# EAGLE design H2BR1 (EAGLE 9.6.1)

## Sheet 1 of 2
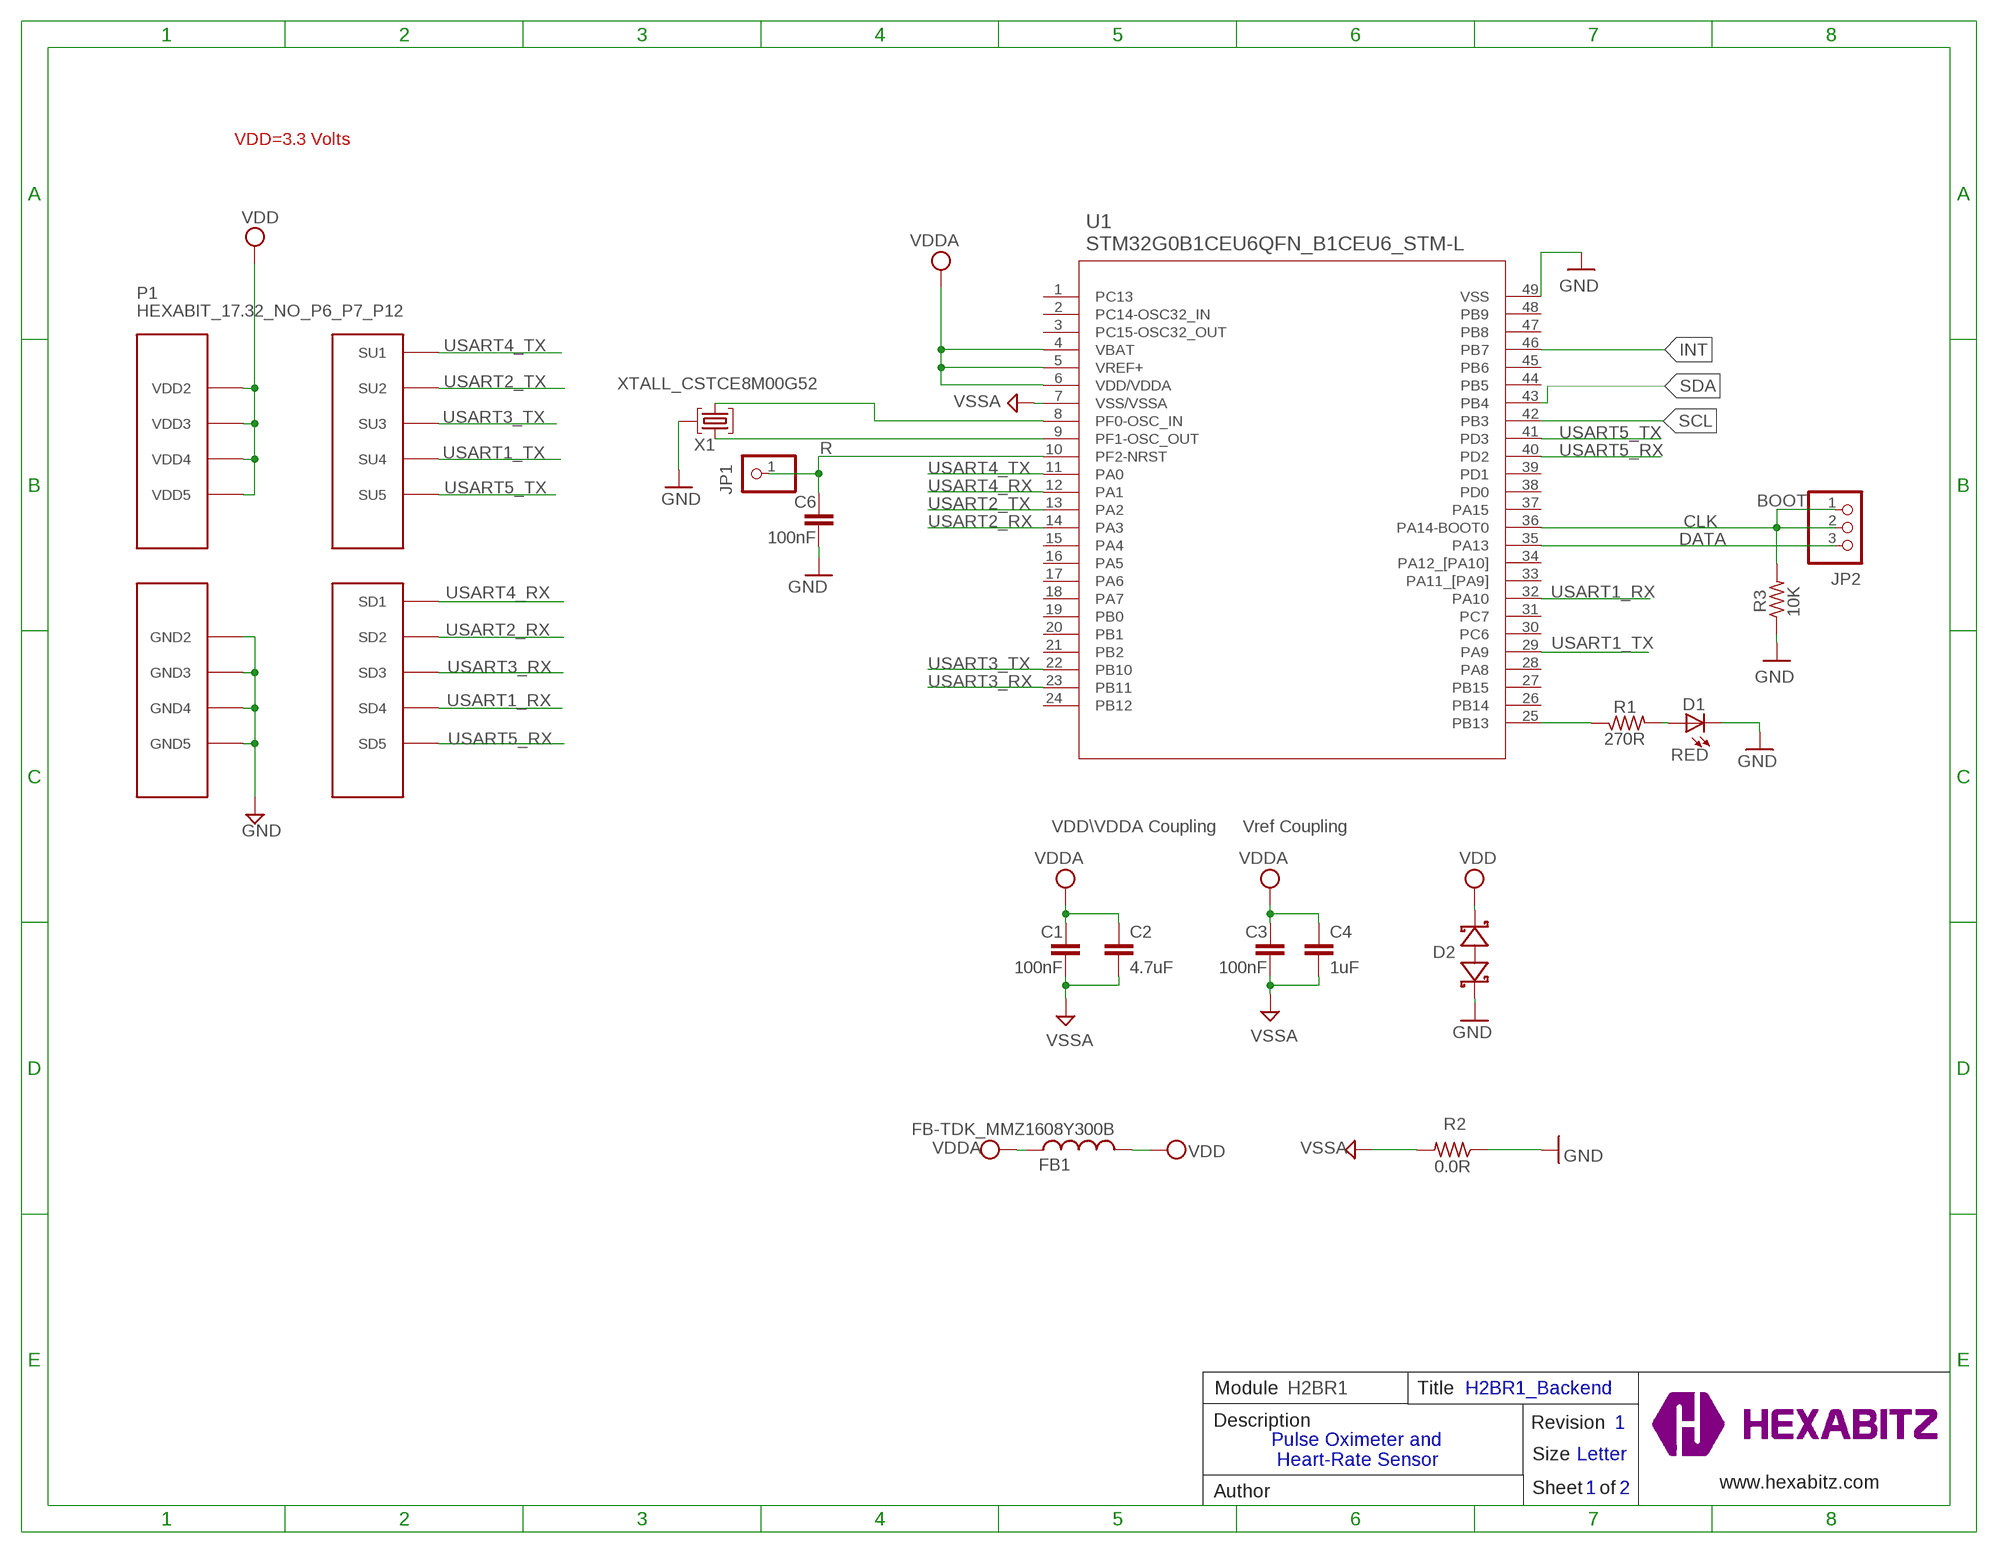
[diagram p0: schematic, sheet 1]

### Parts
C1  100nF  C-0603  [C-0603]
C2  4.7uF  C-0805  [C-0805]
C3  100nF  C-0603  [C-0603]
C4  1uF  C-0805  [C-0805]
C6  100nF  C-0603  [C-0603]
D1  RED  VLMS1300-GS08  [VLMS1300-GS08]
D2  BOURNS_CDSOD323-T03SCBOURNS_CDSOD323-T03SC_0_0  [BOURNS_CDSOD323-T03SC_0]
FB1  FB-TDK_MMZ1608Y300B  FB-0603  [FB-0603]
JP1  R  PINHD-1X1  [1X01]
JP2  PINHD-1X3  [1X03]
P1  HEXABIT_17.32_NO_P6_P7_P12  [HEXABIT_17.32_NO_P6_P7_P12]
R1  270R  R-0603  [R-0603]
R2  0.0R  R-0603  [R-0603]
R3  10K  R-0603  [R-0603]
TRIMBLE-LOGO1  HEXA-LOGO  [HEXA-LOGO]
U1  STM32G0B1CEU6QFN_B1CEU6_STM-L  [QFN_B1CEU6_STM-L]
X1  XTALL_CSTCE8M00G52  [XTALL_CSTCE8M00G52]

### Nets
CLK: JP2.1 JP2.2 R3.2 U1.36(PA14-BOOT0)
DATA: JP2.3 U1.35(PA13)
GND: C6.2 D1.C D2.1(A) P1.PAD_PD8(GND2) P1.PAD_PD9(GND3) P1.PAD_PD10(GND4) P1.PAD_PD11(GND5) R2.1 R3.1 U1.49(VSS) X1.P$2 ; also sheet 2
INT: U1.46(PB7) ; also sheet 2
N$1: R1.1 U1.25(PB13)
N$3: D1.A R1.2
N$4: C6.1 JP1.1 U1.10(PF2-NRST)
N$5: U1.9(PF1-OSC_OUT) X1.P$1
N$6: U1.8(PF0-OSC_IN) X1.P$3
SCL: U1.42(PB3) ; also sheet 2
SDA: U1.43(PB4) ; also sheet 2
USART1_RX: P1.PAD_PD4(SD4) U1.32(PA10)
USART1_TX: P1.PAD_PU4(SU4) U1.29(PA9)
USART2_RX: P1.PAD_PD2(SD2) U1.14(PA3)
USART2_TX: P1.PAD_PU2(SU2) U1.13(PA2)
USART3_RX: P1.PAD_PD3(SD3) U1.23(PB11)
USART3_TX: P1.PAD_PU3(SU3) U1.22(PB10)
USART4_RX: P1.PAD_PD1(SD1) U1.12(PA1)
USART4_TX: P1.PAD_PU1(SU1) U1.11(PA0)
USART5_RX: P1.PAD_PD5(SD5) U1.40(PD2)
USART5_TX: P1.PAD_PU5(SU5) U1.41(PD3)
VDD: D2.2(C) FB1.2 P1.PAD_PU8(VDD2) P1.PAD_PU9(VDD3) P1.PAD_PU10(VDD4) P1.PAD_PU11(VDD5) ; also sheet 2
VDDA: C1.1 C2.1 C3.1 C4.1 FB1.1 U1.4(VBAT) U1.5(VREF+) U1.6(VDD/VDDA)
VSSA: C1.2 C2.2 C3.2 C4.2 R2.2 U1.7(VSS/VSSA)
Unconnected: U1.1(PC13) U1.2(PC14-OSC32_IN) U1.3(PC15-OSC32_OUT) U1.15(PA4) U1.16(PA5) U1.17(PA6) U1.18(PA7) U1.19(PB0) U1.20(PB1) U1.21(PB2) U1.24(PB12) U1.26(PB14) U1.27(PB15) U1.28(PA8) U1.30(PC6) U1.31(PC7) U1.33(PA11_[PA9]) U1.34(PA12_[PA10]) U1.37(PA15) U1.38(PD0) U1.39(PD1) U1.44(PB5) U1.45(PB6) U1.47(PB8) U1.48(PB9)

### Notes on the sheet
- VDD=3.3 Volts
- BOOT
- VDD\VDDA Coupling | Vref Coupling
- Module | H2BR1 | Title | H2BR1_Backend
- Description | Revision | 1
- Size | Letter
- Pulse Oximeter and
   Heart-Rate Sensor
- www.hexabitz.com
- Author | Sheet   of | 1 | 2
- C:/Users/Admin/Desktop/logodraft.bmp

## Sheet 2 of 2
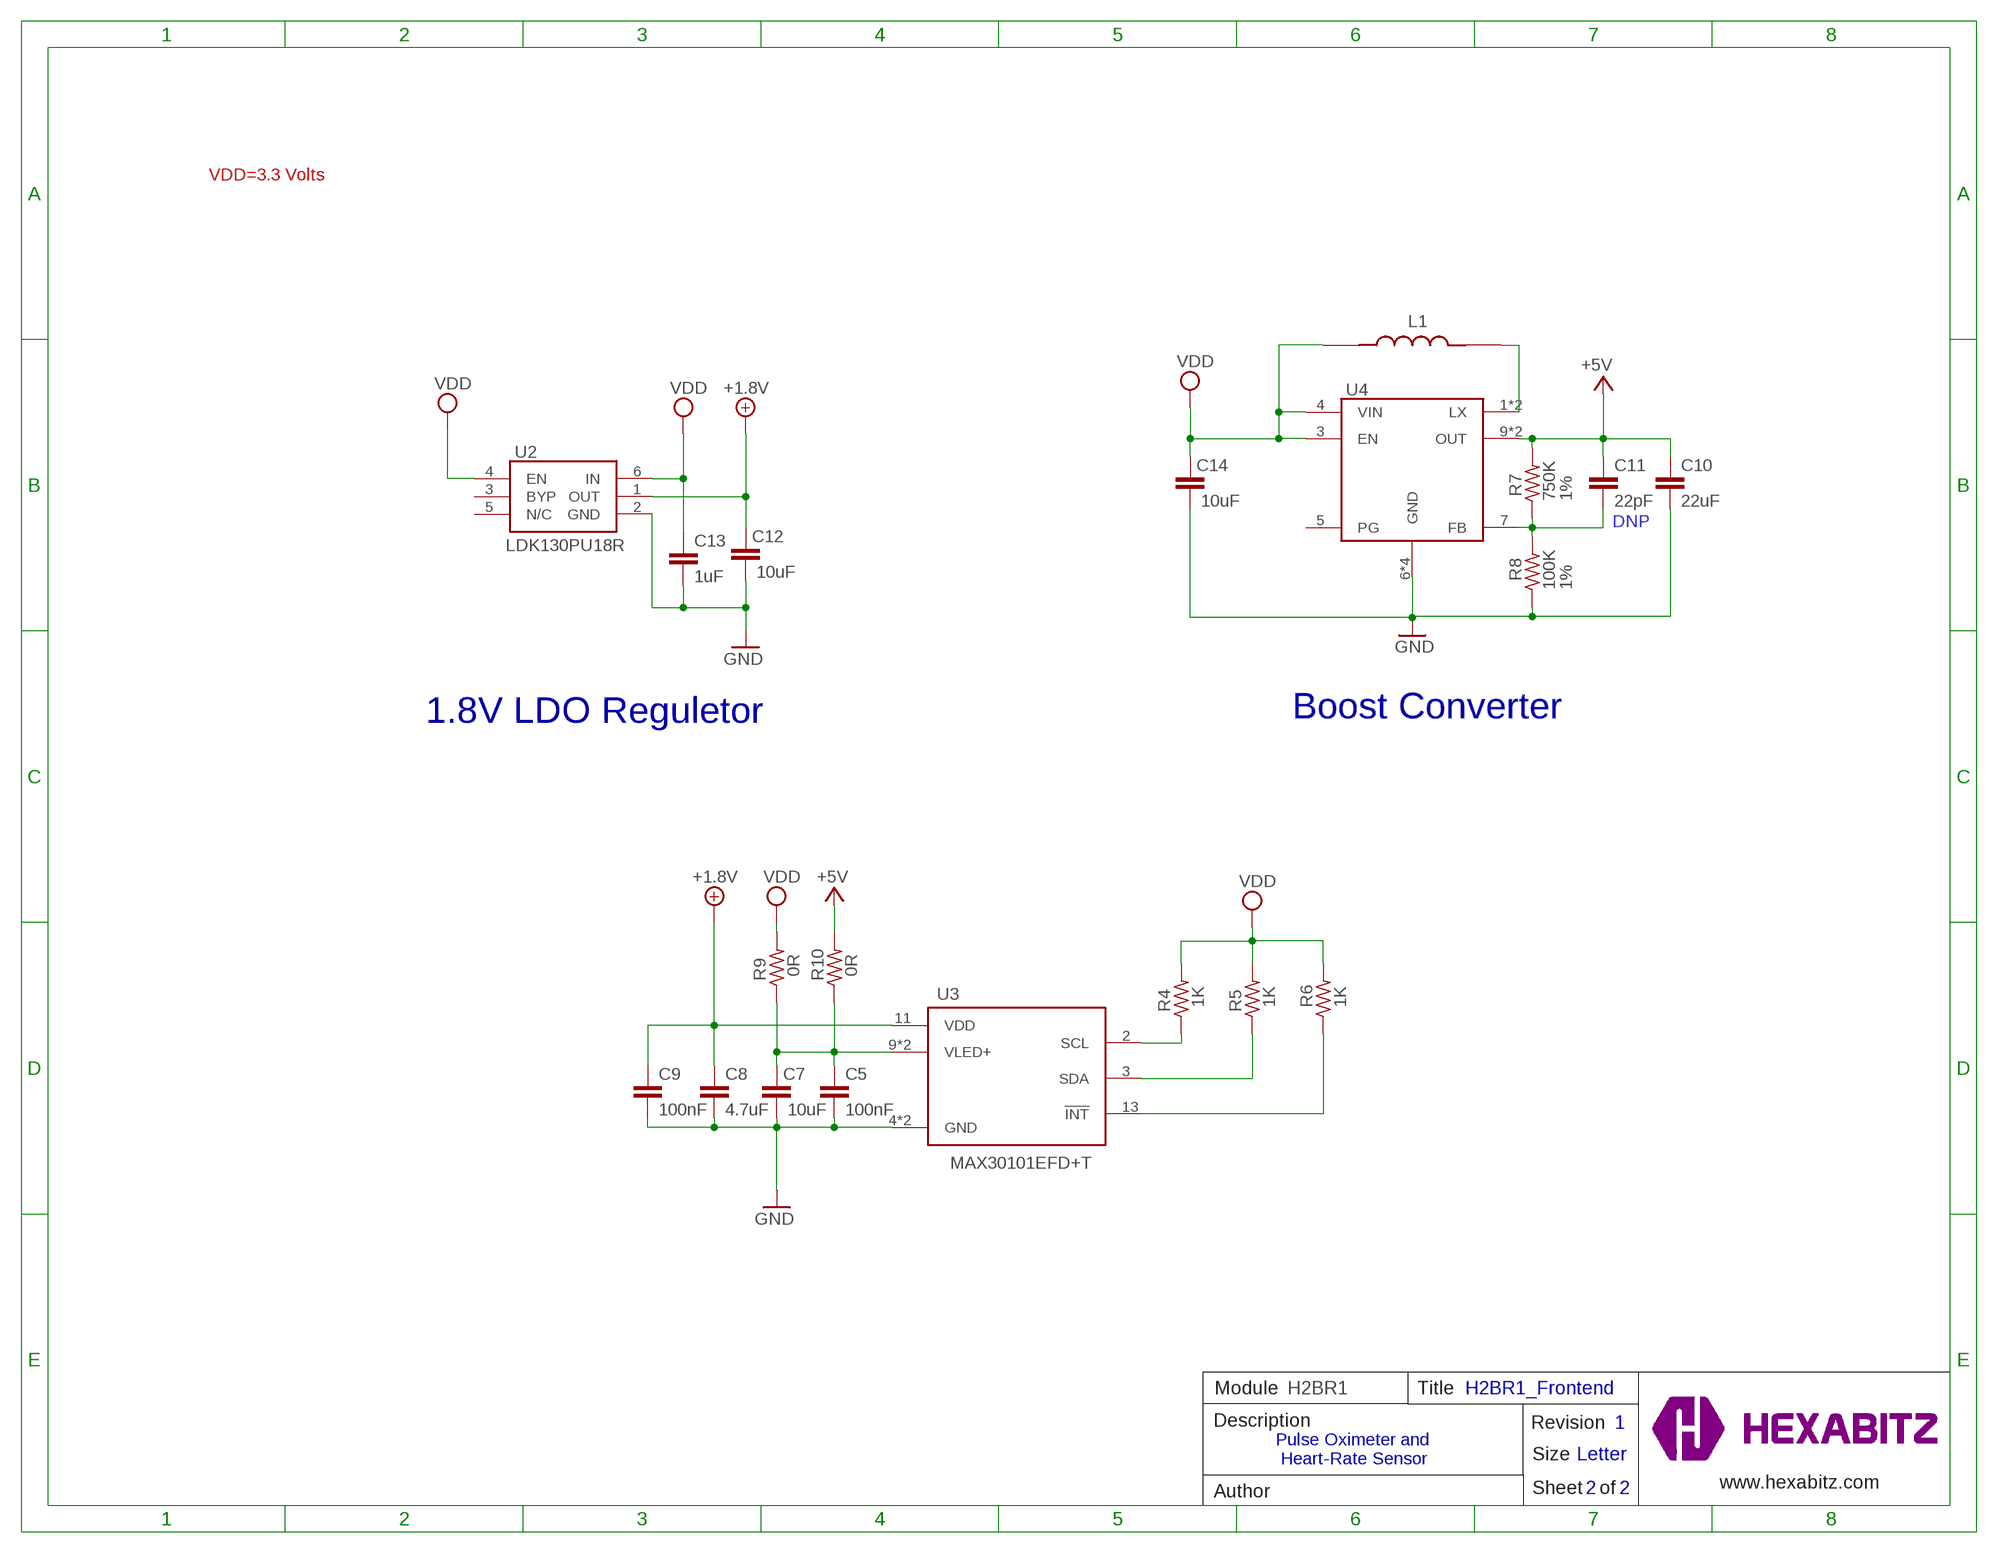
[diagram p1: schematic, sheet 2]

### Parts
C5  100nF  C-0603  [C-0603]
C7  10uF  C-0805  [C-0805]
C8  4.7uF  C-0805  [C-0805]
C9  100nF  C-0603  [C-0603]
C10  22uF  C-0603  [C-0603]
C11  22pF  C-0603  [C-0603]
C12  10uF  C-0805  [C-0805]
C13  1uF  C-0805  [C-0805]
C14  10uF  C-0805  [C-0805]
L1  ASMPH08062R2MT  [INDC1608X95N]
R4  1K  R-0603  [R-0603]
R5  1K  R-0603  [R-0603]
R6  1K  R-0603  [R-0603]
R7  750K  R-0603  [R-0603]
R8  100K  R-0603  [R-0603]
R9  0R  R-0603  [R-0603]
R10  0R  R-0603  [R-0603]
U2  LDK130PU18R  [LDK130PU18R]
U3  MAX30101EFD+T  [14-LEAD-OESIP]
U4  PAM2401YPADJ  [SON45P300X300X63-13N]

### Nets
+1.8V: C8.1 C9.1 C12.1 U2.1(OUT) U3.11(VDD)
+5V: C10.1 C11.1 R7.2 R10.2 U4.9(OUT) U4.10(OUT)
GND: C5.2 C7.2 C8.2 C9.2 C10.2 C12.2 C13.2 C14.2 R8.1 U2.2(GND) U3.4(GND) U3.12(GND) U4.6(GND) U4.11(GND) U4.12(GND) U4.13(GND) ; also sheet 1
INT: R6.1 U3.13(!INT) ; also sheet 1
N$2: C5.1 C7.1 R9.1 R10.1 U3.9(VLED+) U3.10(VLED+)
N$9: C11.2 R7.1 R8.2 U4.7(FB)
N$12: L1.2 U4.1(LX) U4.2(LX)
SCL: R4.1 U3.2(SCL) ; also sheet 1
SDA: R5.1 U3.3(SDA) ; also sheet 1
VDD: C13.1 C14.1 L1.1 R4.2 R5.2 R6.2 R9.2 U2.4(EN) U2.6(IN) U4.3(EN) U4.4(VIN) ; also sheet 1
Unconnected: U2.3(BYP) U2.5(N/C) U4.5(PG)

### Notes on the sheet
- VDD=3.3 Volts
- 1.8V LDO Reguletor | Boost Converter
- Module | H2BR1 | Title | H2BR1_Frontend
- Description | Revision | 1
- Size | Letter
- Pulse Oximeter and
   Heart-Rate Sensor
- www.hexabitz.com
- Author | Sheet   of | 2 | 2

## Library data of the parts
C1 C3 C5 C6 C9 C10 = HEXABITZ_RCLS:C-0603: CAP CER 10% X7R 0603
C2 C4 C7 C8 C12-C14 = HEXABITZ_RCLS:C-0805: CAP CER 10% X7R 0805
C11 = HEXABITZ_RCLS:C-0603: CAP CER 10% X7R 0603; STATUS: DNP
D1 = Hexabitz:VLMS1300-GS08: Red 0603 130° Clear 54 mcd 2 V Surface Mount ChipLED ; Octopart Url : http://octopart.com/vlms1300-gs08-vishay-21709201; MFN: Vishay; MPN: VLMS1300-GS08; OCTOPART_URL: https://octopart.com/vlms1300-gs08-vishay-21709201?r=sp&s=_gcP4_q8T1SC6PJQPTQ9yA
D2 = HEXABITZ_RCLS:BOURNS_CDSOD323-T03SC: CDSOD323-TxxSC - TVS Diode Series; DESCRIPTION: Dio Tvs Vwm 03V 500W Bidir Sod323 / Tape & Reel - 7" Reel; MFN: Bourns; MPN: CDSOD323-T03SC; OCTOPART_URL: https://octopart.com/cdsod323-t03sc-bourns-10487153?r=sp
FB1 = HEXABITZ_RCLS:FB-0603: Ferrite Beads Multi-Layer 0603; MFN: TDK; MPN: MMZ1608Y300B; OCTOPART_URL: https://octopart.com/mmz1608y300b-tdk-368280?r=sp&s=cd9_2ZEqQ9q9UNBuQgHAiA
JP1 = HEXABITZ_USER_INTERFACE_PARTS:PINHD-1X1: PIN HEADER; MFN: TE Connectivity; MPN: 87227-1; OCTOPART_URL: https://octopart.com/87227-1-te+connectivity-39512052?r=sp
JP2 = pinhead:PINHD-1X3: PIN HEADER
L1 = HEXABITZ_RCLS:ASMPH08062R2MT; MPN: ASMPH-0806-2R2M-T
P1 = hexabitz_connectors:HEXABIT_?_NO_P6_P7_P12: Hexabitz Hexagon Module Connector Hexagon side length = 17.32mm. The following ports are removed: P6 P7 P12
R1 R3-R6 R9 R10 = HEXABITZ_RCLS:R-0603: Thick Film Resistors - SMD 0603
R2 = HEXABITZ_RCLS:R-0603: Thick Film Resistors - SMD 0603; MFN: Yageo; MPN: RC0603JR-070RL; OCTOPART_URL: https://octopart.com/rc0603jr-070rl-yageo-1241539?r=sp&s=X2NteqRjRNWrnx42Y0aliA; RESISTANCE: 0.0 Ohm
R7 R8 = HEXABITZ_RCLS:R-0603: Thick Film Resistors - SMD 0603; TOLERANCE: 1%
TRIMBLE-LOGO1 = HEXABITZ_USER_INTERFACE_PARTS:HEXA-LOGO: Trimble-Logo
U1 = HEXABITZ_ICs:STM32G0B1CEU6; COPYRIGHT: Copyright (C) 2021 Ultra Librarian. All rights reserved.; MANUFACTURER_PART_NUMBER: STM32G0B1CEU6; MFR_NAME: STMicroelectronics
U2 = HEXABITZ_ICs:LDK130PU18R: LDO Voltage Regulators 300mA current very low noise LDO Source: Datasheet <http://www.st.com/web/en/resource/technical/document/datasheet/DM00076097.pdf>; DESCRIPTION: LDO Voltage Regulators 300mA current very low noise LDO; HEIGHT: 0.5mm; MANUFACTURER_NAME: STMicroelectronics; MANUFACTURER_PART_NUMBER: LDK130PU18R; MOUSER_PART_NUMBER: 511-LDK130PU18R; MOUSER_PRICE-STOCK: https://www.mouser.co.uk/ProductDetail/STMicroelectronics/LDK130PU18R?qs=Us3gTOFd0HosQ%2FeNbz5XPw%3D%3D
U3 = HEXABITZ_ICs:MAX30101EFD+T: Biometric Sensors Integrated Optical Sensor Source: Datasheet <https://datasheets.maximintegrated.com/en/ds/MAX30101.pdf>; ARROW_PART_NUMBER: MAX30101EFD+T; ARROW_PRICE-STOCK: https://www.arrow.com/en/products/max30101efdt/maxim-integrated?region=nac; DESCRIPTION: Biometric Sensors Integrated Optical Sensor; HEIGHT: mm; MANUFACTURER_NAME: Analog Devices; MANUFACTURER_PART_NUMBER: MAX30101EFD+T; MOUSER_PART_NUMBER: 700-MAX30101EFD+T; MOUSER_PRICE-STOCK: https://www.mouser.co.uk/ProductDetail/Analog-Devices-Maxim-Integrated/MAX30101EFD%2bT?qs=sITqEBh490kEm6CNcTH1tQ%3D%3D
U4 = HEXABITZ_ICs:PAM2401YPADJ: Up to 95% Efficiency True Output Disconnect Inrush Current Limiting When Power On Output Current up to 1000mA at VIN = 3V and VOUT = 5.0V Fixed Frequency Operation Up to 1MHz 0.9V to 4.75V Input Range 2.5V to 5.0V Adjustable Output Voltage Guaranteed 1.0V Start-Up Programmable Current Limit Internal Soft-Start Internal Compensation Pulse Sipping Mode at Light Load Operation Hiccup Mode Short Protection Over Voltage Protection Over Temperature Protection <1A Shut Source: Datasheet <https://www.diodes.com//assets/Datasheets/PAM2401.pdf>; DESCRIPTION: Up to 95% Efficiency True Output Disconnect Inrush Current Limiting When Power On Output Current up to 1000mA at VIN = 3V and VOUT = 5.0V Fixed Frequency Operation Up to 1MHz 0.9V to 4.75V Input Range 2.5V to 5.0V Adjustable Output Voltage Guaranteed 1.0V Start-Up Programmable Current Limit Internal Soft-Start Internal Compensation Pulse Sipping Mode at Light Load Operation Hiccup Mode Short Protection Over Voltage Protection Over Temperature Protection <1A Shut; HEIGHT: 0.63mm; MANUFACTURER_NAME: Diodes Incorporated; MANUFACTURER_PART_NUMBER: PAM2401YPADJ; MOUSER_PART_NUMBER: 621-PAM2401YPADJ; MOUSER_PRICE-STOCK: https://www.mouser.co.uk/ProductDetail/Diodes-Incorporated/PAM2401YPADJ?qs=Ay79KZaUeZCVTGl4%252BbGCig%3D%3D
X1 = Hexabitz:XTALL_CSTCE8M00G52: MURATA CSTCE8M00G52-R0 RESONATOR, SMD, 8MHZ ; Octopart Url : https://octopart.com/cstce8m00g52-r0-murata-7145559; MFN: Murata; MPN: CSTCE8M00G52Z-R0; OCTOPART_URL: https://octopart.com/cstce8m00g52z-r0-murata-17755941?r=sp&s=JDnNJnrHQhyS8Zk4ofFWXw

## Board
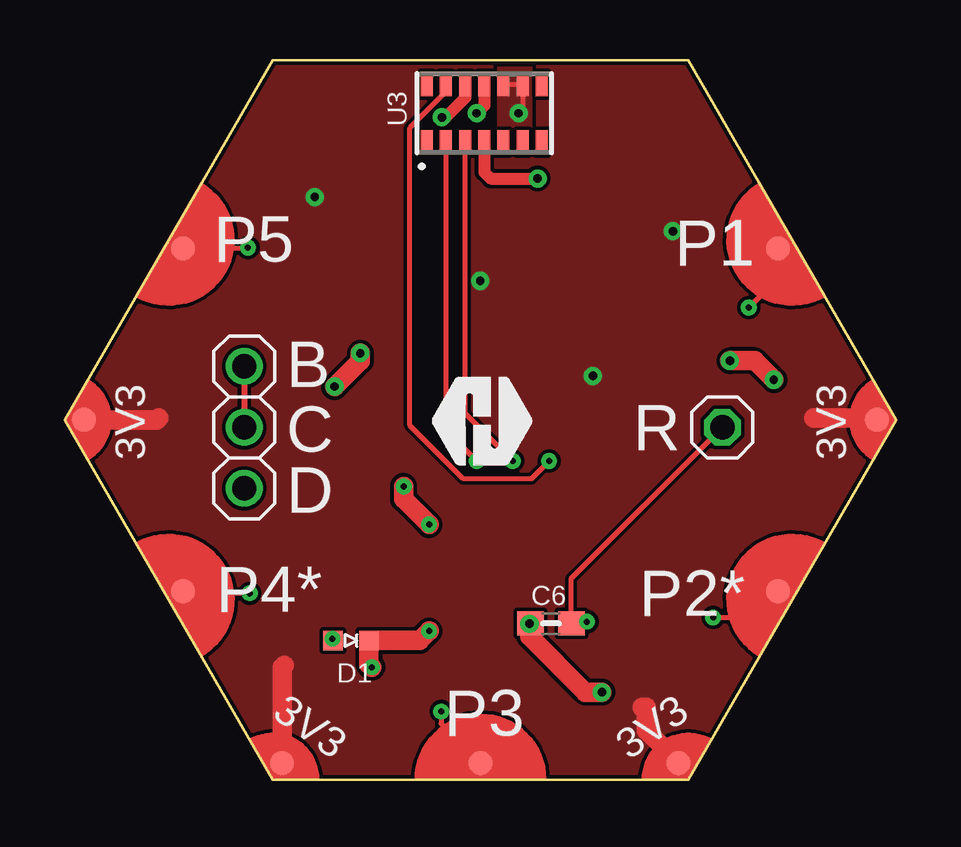
[diagram p2: board, top side]
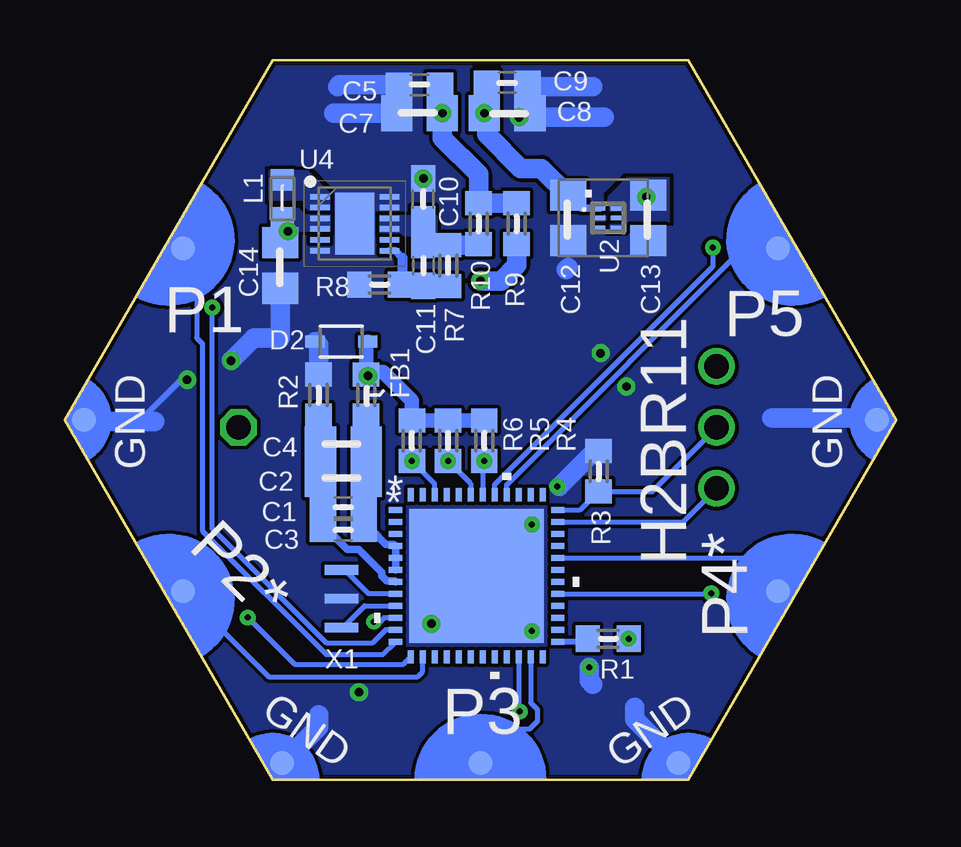
[diagram p3: board, bottom side, seen from below]

Size 34.64 x 30 mm. Coordinates in mm from the lower left corner, seen from the top.
Copper layers (1*16): Top 0.035mm / dielectric 1.5mm / Bottom 0.035mm
Design rules "Ibrahim *": minimum track width 6mil, minimum drill 0.25mm, track to track 6mil, track to pad 6mil, pad to pad 6mil, via to via 6mil, smd to smd 0mil, copper to edge 0.15mm, drill to drill 6mil, minimum pad ring 10mil, minimum via ring 8mil, stop-mask expansion 4mil, vias tented up to drill 24mil, thermal gap 10mil

### Footprints (pad centres in the part's own frame; a part is rotated, then mirrored left to right if it is on the bottom)
C-0603 = smd 1.1 x 1: 1 -0.85,0; 2 0.85,0
C-0805 = smd 1.3 x 1.5: 1 -0.95,0; 2 0.95,0
VLMS1300-GS08 = smd 0.8 x 0.8: A 0,0.75; C 0,-0.75
BOURNS_CDSOD323-T03SC_0 = smd 0.8 x 0.5: 1 -1.1,0; 2 1.1,0
FB-0603 = smd 1 x 1.1: 1 -0.85,0; 2 0.85,0
1X01 = drill 1.016 octagon: 1 0,0
1X03 = drill 1.016: 1 -2.54,0; 2 0,0; 3 2.54,0
INDC1608X95N = smd 0.9 x 0.97: 1 -0.785,0; 2 0.785,0
HEXABIT_17.32_NO_P6_P7_P12 = smd 1 x 1 bottom: PAD_PD1 12.39,7.15; PAD_PD2 12.39,-7.15; PAD_PD3 0,-14.31; PAD_PD4 -12.39,-7.15; PAD_PD5 -12.39,7.15; PAD_PD8 16.52,0; PAD_PD9 8.26,-14.31; PAD_PD10 -8.26,-14.31; PAD_PD11 -16.52,0 | smd 1 x 1: PAD_PU1 12.39,7.15; PAD_PU2 12.39,-7.15; PAD_PU3 0,-14.31; PAD_PU4 -12.39,-7.15; PAD_PU5 -12.39,7.15; PAD_PU8 16.52,0; PAD_PU9 8.26,-14.31; PAD_PU10 -8.26,-14.31; PAD_PU11 -16.52,0
R-0603 = smd 1 x 1.1: 1 -0.85,0; 2 0.85,0
QFN_B1CEU6_STM-L = smd 0.55 x 0.254: 1 -3.38,2.751; 2 -3.38,2.251; 3 -3.38,1.75; 4 -3.38,1.25; 5 -3.38,0.75; 6 -3.38,0.25; 7 -3.38,-0.25; 8 -3.38,-0.75; 9 -3.38,-1.25; 10 -3.38,-1.75; 11 -3.38,-2.251; 12 -3.38,-2.751; 25 3.38,-2.751; 26 3.38,-2.251; 27 3.38,-1.75; 28 3.38,-1.25; 29 3.38,-0.75; 30 3.38,-0.25; 31 3.38,0.25; 32 3.38,0.75; 33 3.38,1.25; 34 3.38,1.75; 35 3.38,2.251; 36 3.38,2.751 | smd 0.254 x 0.55: 13 -2.751,-3.38; 14 -2.251,-3.38; 15 -1.75,-3.38; 16 -1.25,-3.38; 17 -0.75,-3.38; 18 -0.25,-3.38; 19 0.25,-3.38; 20 0.75,-3.38; 21 1.25,-3.38; 22 1.75,-3.38; 23 2.251,-3.38; 24 2.751,-3.38; 37 2.751,3.38; 38 2.251,3.38; 39 1.75,3.38; 40 1.25,3.38; 41 0.75,3.38; 42 0.25,3.38; 43 -0.25,3.38; 44 -0.75,3.38; 45 -1.25,3.38; 46 -1.75,3.38; 47 -2.251,3.38; 48 -2.751,3.38 | smd 5.6 x 5.6: 49 0,0
LDK130PU18R = smd 0.18 x 0.46: 1 -0.4,-0.34; 2 0,-0.34; 3 0.4,-0.34; 4 0.4,0.34; 5 0,0.34; 6 -0.4,0.34
14-LEAD-OESIP = smd 1 x 0.5: 1 -1.2,2.4; 2 -1.2,1.6; 3 -1.2,0.8; 4 -1.2,0; 5 -1.2,-0.8; 6 -1.2,-1.6; 7 -1.2,-2.4; 8 1.2,-2.4; 9 1.2,-1.6; 10 1.2,-0.8; 11 1.2,0; 12 1.2,0.8; 13 1.2,1.6; 14 1.2,2.4
SON45P300X300X63-13N = smd 0.8 x 0.23: 1 -1.45,1.125; 2 -1.45,0.675; 3 -1.45,0.225; 4 -1.45,-0.225; 5 -1.45,-0.675; 6 -1.45,-1.125; 7 1.45,-1.125; 8 1.45,-0.675; 9 1.45,-0.225; 10 1.45,0.225; 11 1.45,0.675; 12 1.45,1.125 | smd 1.63 x 2.6: 13 0,0
XTALL_CSTCE8M00G52 = smd 1.4 x 0.4: P$1 0,1.2; P$2 0,0; P$3 0,-1.2

### Placement (x,y rotation side)
C1  23.04,11.35 180 bottom
C2  23.04,12.54 180 bottom
C3  23.04,10.4 180 bottom
C4  23.04,13.97 180 bottom
C5  19.86,28.97 180 bottom
C6  20.26,6.51 180 top
C7  19.86,27.78 180 bottom
C8  16.21,27.78 0 bottom
C9  16.21,29.05 0 bottom
C10  19.7,24.21 90 bottom
C11  19.7,21.43 270 bottom
C12  13.67,23.41 270 bottom
C13  10.34,23.41 270 bottom
C14  25.65,21.43 270 bottom
D1  11.92,5.79 90 top
D2  23.11,18.25 0 bottom
FB1  22.08,16.03 90 bottom
JP1  27.4,14.68 0 top
JP2  7.48,14.68 270 top
L1  25.58,24.21 90 bottom
P1  17.32,15 0 top
R1  12,5.87 0 bottom
R2  24.07,16.03 270 bottom
R3  12.4,12.86 270 bottom
R4  17.16,14.13 90 bottom
R5  18.67,14.13 90 bottom
R6  20.18,14.13 90 bottom
R7  18.67,21.43 90 bottom
R8  21.53,20.64 0 bottom
R9  15.81,23.18 270 bottom
R10  17.4,23.18 270 bottom
TRIMBLE-LOGO1  17.4,13.1 0 top
U1  17.48,8.49 0 bottom
U2  12,23.41 270 bottom
U3  17.48,27.78 90 top
U4  22.56,23.18 0 bottom
X1  23.11,7.54 180 bottom

### Tracks (layer width: path | path; a pad name or v marks a point on that pad's centre or on a via)
+1.8V  (via drill 0.35 pad 0.75)
  Top 0.508: U3.11 17.48,28.1 C8.1
  Bottom 0.254: 13.28,23.97 13.51,24.21 C12.1
  Bottom 0.305: C9.1 17.16,28.95 C8.1 | U2.1 13.12,23.81 13.51,24.21
  Bottom 0.508: 17.06,27.88 C8.1
  Bottom 0.813: C9.1 17.06,26.9 15.63,25.48 14.78,25.48 C12.1
  other vias: 17.16,27.78
+5V
  Bottom 0.61: C10.1 C11.1 R7.2
  Bottom 0.813: R7.2 17.45,22.28 R10.2
  pour Bottom (no thermals): 21.53,23.49 21.53,22.7 19.15,22.7 19.15,23.49
CLK
  Top 0.254: JP2.1 JP2.2
  Bottom 0.203: U1.36 13.16,11.24 R3.2 10.15,12.01 JP2.2
DATA
  Bottom 0.203: U1.35 8.88,10.74 JP2.3
GND  (via drill 0.25 pad 0.55, 0.35 pad 0.75)
  Top 0.203: C6.2 19.4,6.5 v19.36,6.5
  Top 0.508: U3.4 17.48,25.32 17.74,25.06 C10.2 | U3.12 16.69,28.96 16.69,28.43 15.87,27.61 v15.71,27.61
  Top 0.813: v22.38,3.64 21.7,3.64 19.36,5.97 v19.36,6.5 | v15.18,10.63 14.12,11.69 v14.12,12.22 | v15.18,6.19 14.78,5.79 D1.C 12.67,4.81 v12.8,4.68 | v29.54,16.67 28.75,17.46 v27.71,17.46 | v12.31,17.78 12.31,17.45 v11.24,16.38
  Bottom 0.254: 31.53,14.92 29.78,16.67 v29.54,16.67
  Bottom 0.508: v15.71,27.61 15.43,27.61 C8.2
  Bottom 0.813: C7.2 23.43,27.78 | C5.2 23.19,28.97 23.27,28.89 | C9.2 15.2,28.89 12.64,28.89 | C8.2 15.1,27.62 12.16,27.62 | P1.PAD_PD9 24.07,2.2 24.07,2.7 | P1.PAD_PD10 10.89,2.52 10.89,3.01 | P1.PAD_PD11 0.88,15.08 5.18,15.08 | P1.PAD_PD8 33.76,14.92 31.53,14.92 30.89,14.92 | R3.1 12.56,13.71 14.04,12.22 | U1.49 17.32,8.49 v15.18,10.63 | v15.18,6.19 U1.49 | U1.49 19.36,6.61 v19.36,6.5 | v12.8,4.68 12.8,4.13 12.64,3.97 | v27.71,17.46 26.76,18.41 25.65,18.41 C14.2 | 13.75,21.27 13.67,21.35 | R2.1 24.07,18.11 D2.1
  other vias: 19.7,25.06
  pour Bottom (rank 3, no thermals): 8.64,0.09 26,0.09 34.6,14.99 25.94,29.99 8.55,29.99 -0.04,15.12
INT  (via drill 0.25 pad 0.55)
  Top 0.203: R6.1 19.44,12.54 16.61,12.54 14.38,14.76 14.38,27.17 15.88,28.67 U3.13
  Bottom 0.203: U1.46 19.23,12.33 R6.1
  other vias: 20.18,13.28
N$1
  Bottom 0.254: R1.1 12.98,5.74 U1.25
N$2  (via drill 0.35 pad 0.75)
  Top 0.203: U3.10 U3.9 19.08,27.95 C7.1
  Bottom 0.203: C5.1 19.01,27.88 C7.1
  Bottom 0.813: R9.1 R10.1 17.4,25.24 18.91,26.75 C7.1
  other vias: 18.91,27.78
  pour Top (no thermals): 18.03,29.68 18.03,27.14 19.46,27.14 19.46,29.68
N$3  (via drill 0.25 pad 0.55)
  Top 0.254: R1.2 11.17,5.85 D1.A
  other vias: 11.15,5.87
N$4  (via drill 0.25 pad 0.55)
  Top 0.203: JP1.1 21.11,8.39 C6.1 21.68,6.51 v21.76,6.58
  Bottom 0.203: v21.76,6.58 21.49,6.58 21.33,6.74 U1.10
N$5
  Bottom 0.203: X1.P$1 23.04,6.34 22.14,7.24 U1.9
N$6
  Bottom 0.203: U1.8 21.97,7.74 22.96,8.74 X1.P$3
N$9
  Bottom 0.305: U4.7 20.88,22.05 20.57,21.75
  Bottom 0.406: 20.57,21.75 20.57,20.74 R8.2 19.76,20.64 C11.2 R7.1
N$12
  pour Bottom (no thermals): 23.59,24.45 23.59,23.73 24.46,23.73 24.68,23.95 24.68,24.11 24.7,24.13 26.13,24.13 26.13,25.4 24.54,25.4
SCL  (via drill 0.25 pad 0.55)
  Top 0.203: U3.2 15.88,14.56 R4.1
  Bottom 0.203: R4.1 17.23,13.21 U1.42
  other vias: 17.16,13.28
SDA  (via drill 0.25 pad 0.55)
  Top 0.203: R5.1 16.68,15.27 U3.3
  Bottom 0.203: R5.1 17.73,12.34 U1.43
  other vias: 18.67,13.28
USART1_RX
  Bottom 0.203: U1.32 6.32,9.24 P1.PAD_PD4
USART1_TX  (via drill 0.25 pad 0.55)
  Top 0.203: v7.7,7.77 5.01,7.77 P1.PAD_PU4
  Bottom 0.203: U1.29 7.73,7.74 v7.7,7.77
USART2_RX
  Bottom 0.203: P1.PAD_PD2 26.14,4.28 19.94,4.28 19.73,4.49 U1.14
USART2_TX  (via drill 0.25 pad 0.55)
  Top 0.203: v27.01,6.76 28.61,6.76 P1.PAD_PU2
  Bottom 0.203: U1.13 20.55,4.79 25.05,4.79 v27.01,6.76
USART3_RX
  Bottom 0.203: U1.23 15.23,3.2 14.94,2.92 14.94,2.44 15.29,2.1 15.91,2.1 P1.PAD_PD3
USART3_TX  (via drill 0.25 pad 0.55)
  Top 0.203: v15.69,2.84 15.69,2.32 P1.PAD_PU3
  Bottom 0.203: U1.22 15.73,2.88 v15.69,2.84
USART4_RX
  Bottom 0.203: P1.PAD_PD1 29.15,21.59 29.15,18.41 28.91,18.18 28.91,10.37 23.75,5.21 21.39,5.21 U1.12
USART4_TX  (via drill 0.25 pad 0.55)
  Top 0.203: v28.5,19.67 29.71,20.88 P1.PAD_PU1
  Bottom 0.203: v28.5,19.67 28.5,10.47 23.72,5.68 21.83,5.68 21.28,6.24 U1.11
USART5_RX
  Bottom 0.203: U1.40 16.23,12.29 6.05,22.47 5.25,22.47 P1.PAD_PD5
USART5_TX  (via drill 0.25 pad 0.55)
  Top 0.203: P1.PAD_PU5 7.61,22.15 v7.63,22.18
  Bottom 0.203: U1.41 16.73,12.29 7.63,21.39 v7.63,22.18
VDD  (via drill 0.35 pad 0.75)
  Top 0.813: P1.PAD_PU9 24.23,2.04 24.23,3.01 24.07,3.01 | P1.PAD_PU8 33.76,15.08 31.21,15.08 | P1.PAD_PU11 3.83,15 3.91,15.08 | P1.PAD_PU10 9.06,4.68 9.14,4.76
  Bottom 0.203: FB1.2 22.06,16.88 v22,16.83
  Bottom 0.61: D2.2 22.08,18.19 FB1.2 21.98,16.98 21.37,16.98 20.18,15.79 R6.2 R5.2 R4.2
  Bottom 0.813: R9.2 15.81,21.44 16.46,20.79 v17.31,20.79
  other vias: 10.41,24.29 25.34,22.86
  pour Top (rank 2): 8.66,0.09 26.02,0.09 34.57,14.98 25.93,30.02 8.61,29.99 0.01,15.09
  pour Bottom (rank 2, no thermals): 23.59,23.55 23.59,22.86 25.97,22.86 25.97,23.81 24.86,23.81 24.6,23.55
  pour Bottom (no thermals): 12,22.86 11.37,22.86 11.05,23.18 9.46,23.18 9.46,25.08 11.21,25.08 12,24.29
VDDA
  Bottom 0.203: U1.5 U1.6
  Bottom 0.305: U1.6 U1.4 20.93,9.81 21.26,9.81 21.85,10.4 C3.1 C1.1 22.18,12.44 C2.1 22.08,13.26 22.16,13.33 22.16,13.89 C4.1 FB1.1
VSSA
  Bottom 0.305: U1.7 20.9,8.28 21.23,8.28 21.44,8.49 21.44,8.64 22.39,9.59 22.86,9.59 23.67,10.4 C3.2 C1.2 23.88,12.44 C2.2 C4.2 24.07,14.05 R2.2

### Text on the board
tPlace: P5 | P1 | 3V3 | 3V3 | P4* | P2* | P3 | 3V3 | 3V3
bPlace: P1 | P5 | GND | GND | H2BR11 | * | P2* | P4* | P3 | GND | GND
tNames: B | R | C | D
bNames: .